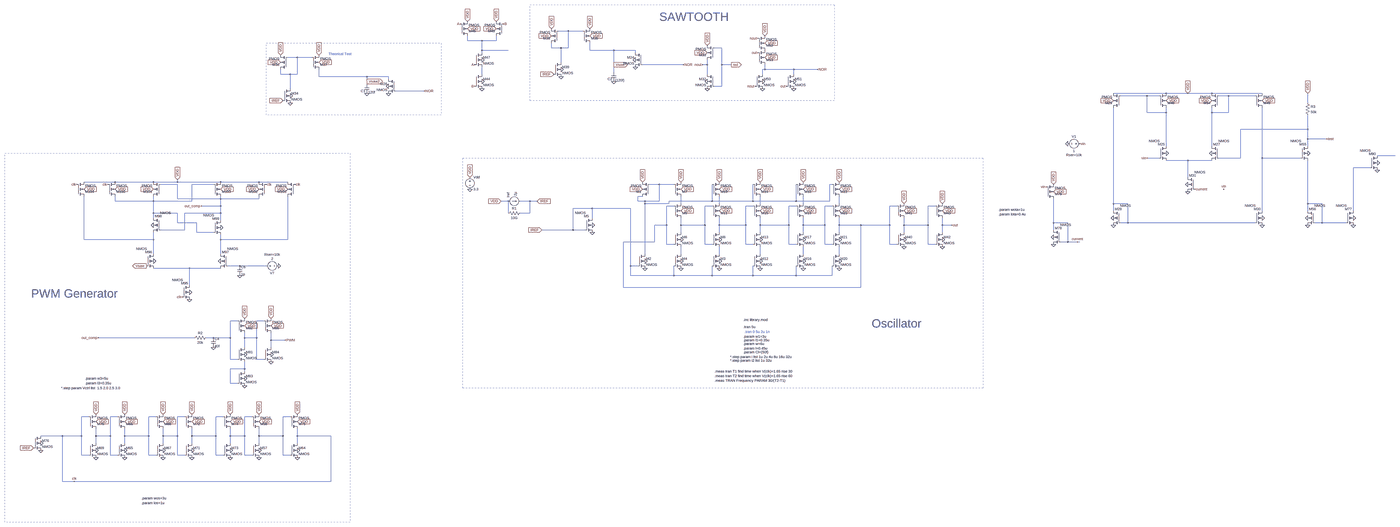
[diagram p0: schematic projet.asc, whole sheet]
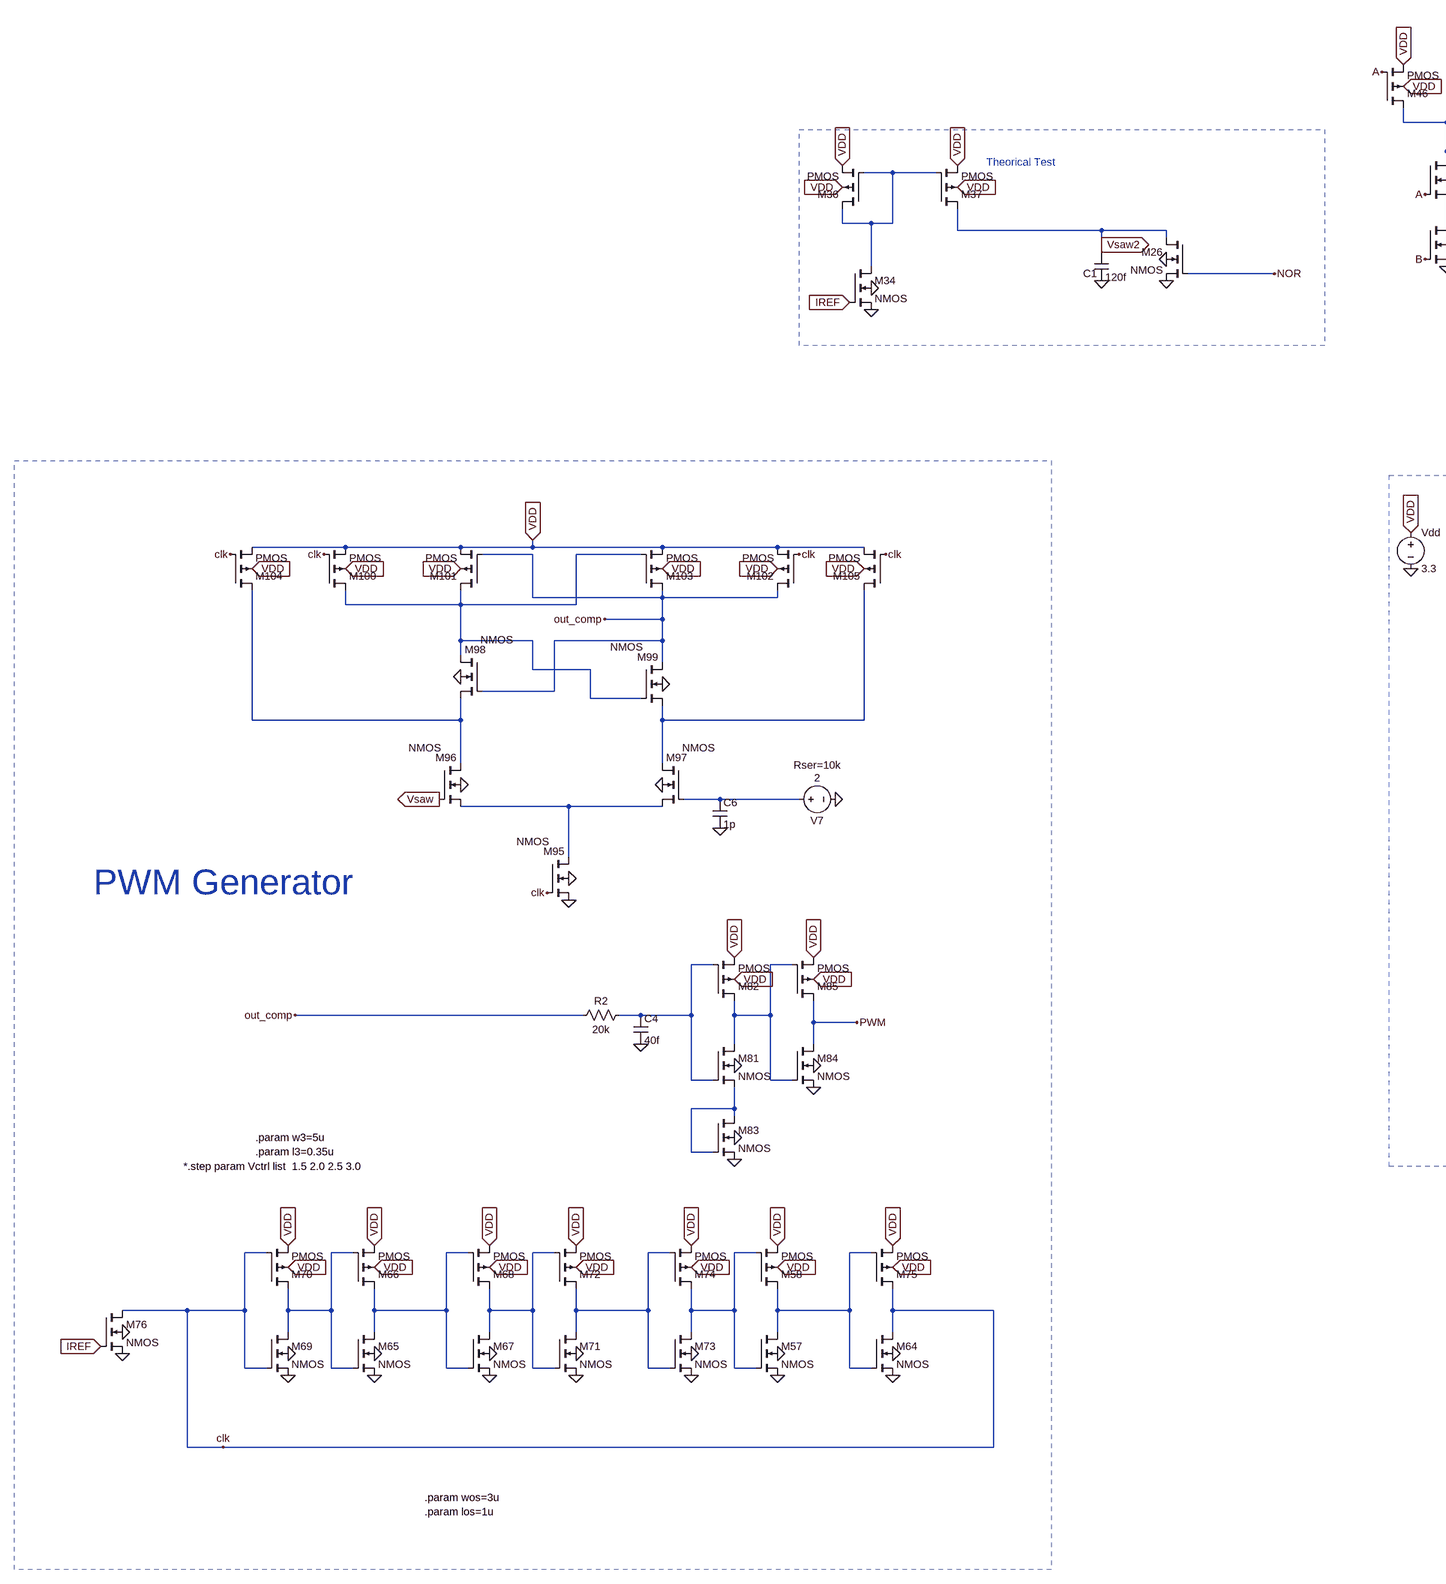
[diagram p1: schematic projet.asc, part, row 1 of 1, column 1 of 3]
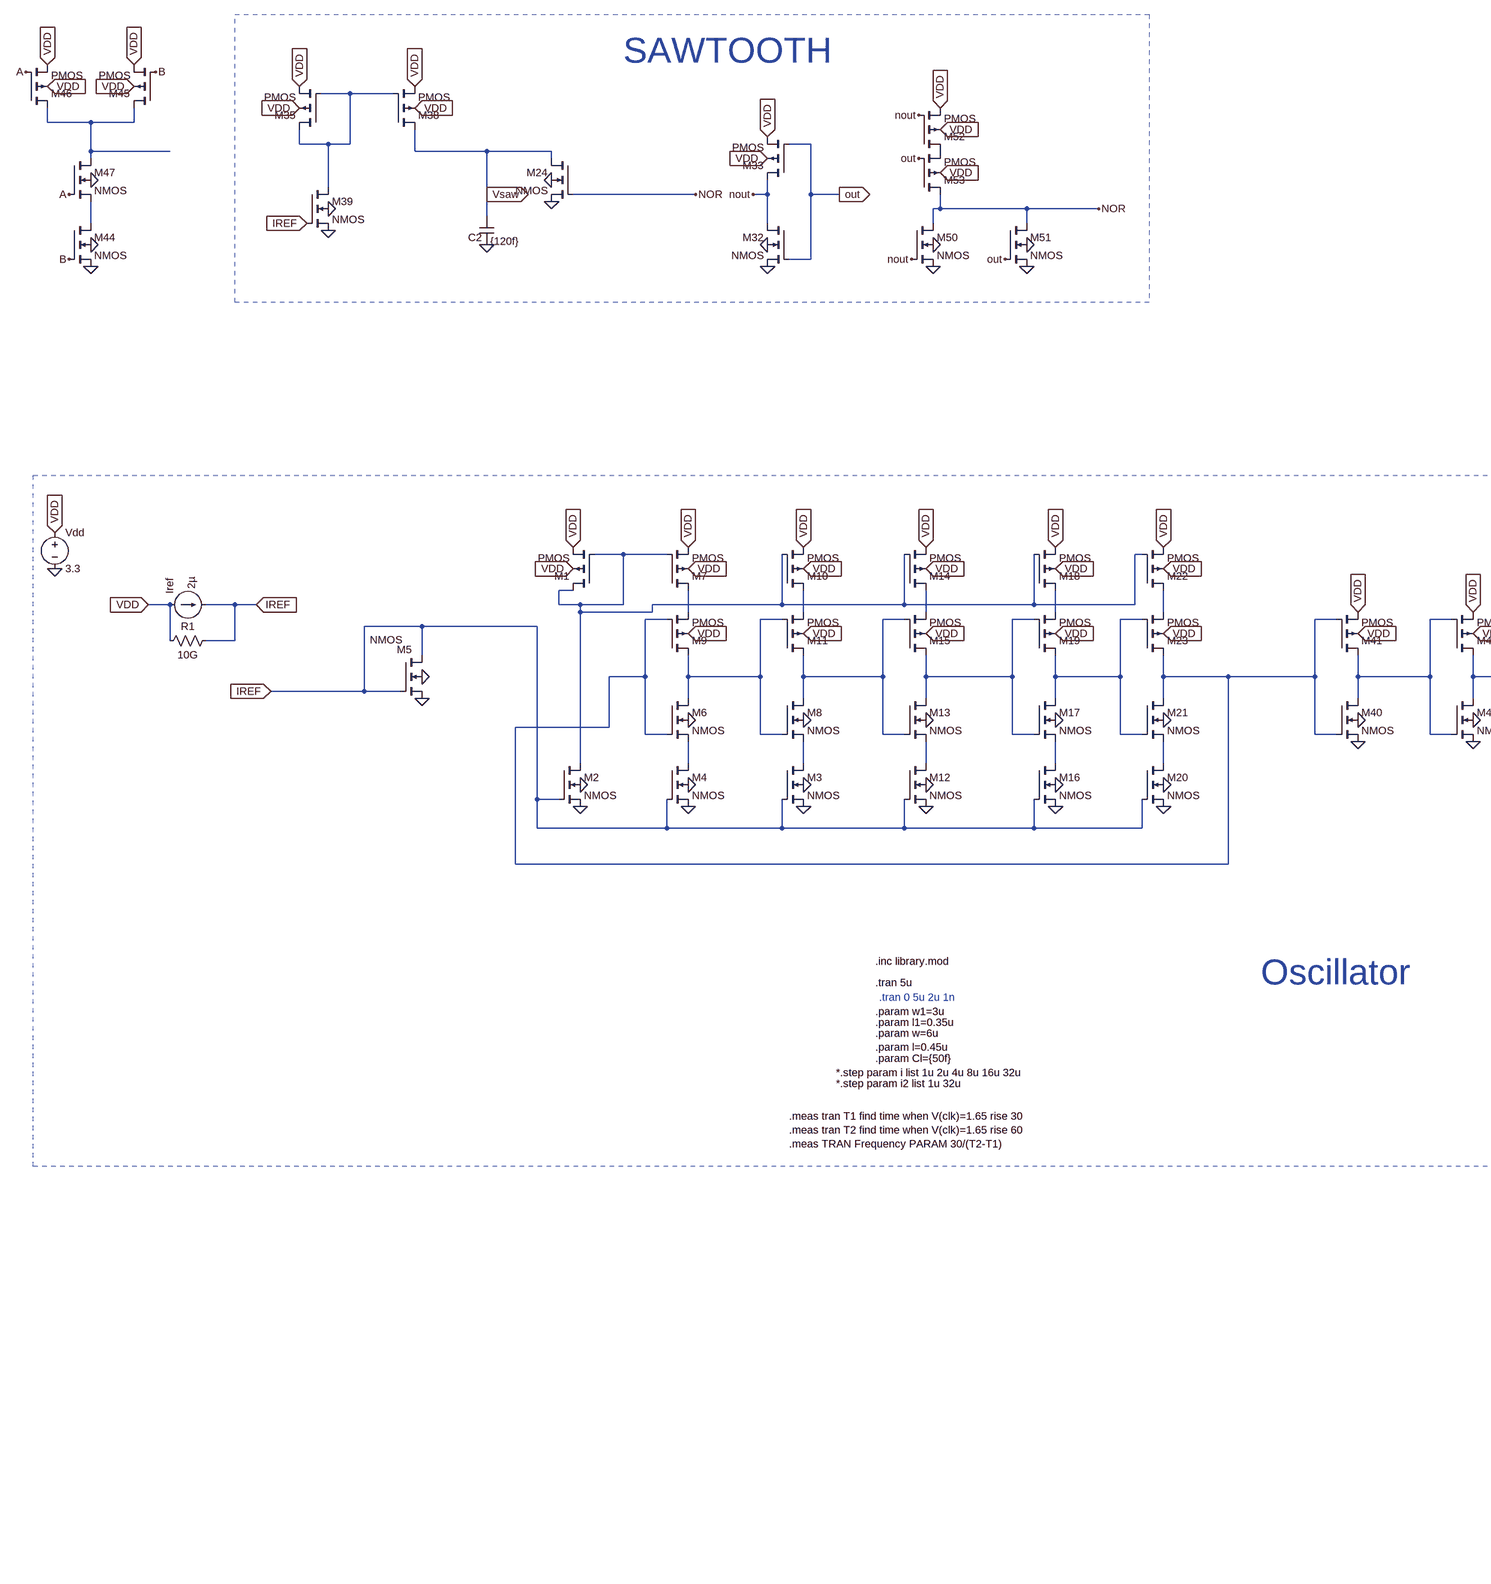
[diagram p2: schematic projet.asc, part, row 1 of 1, column 2 of 3]
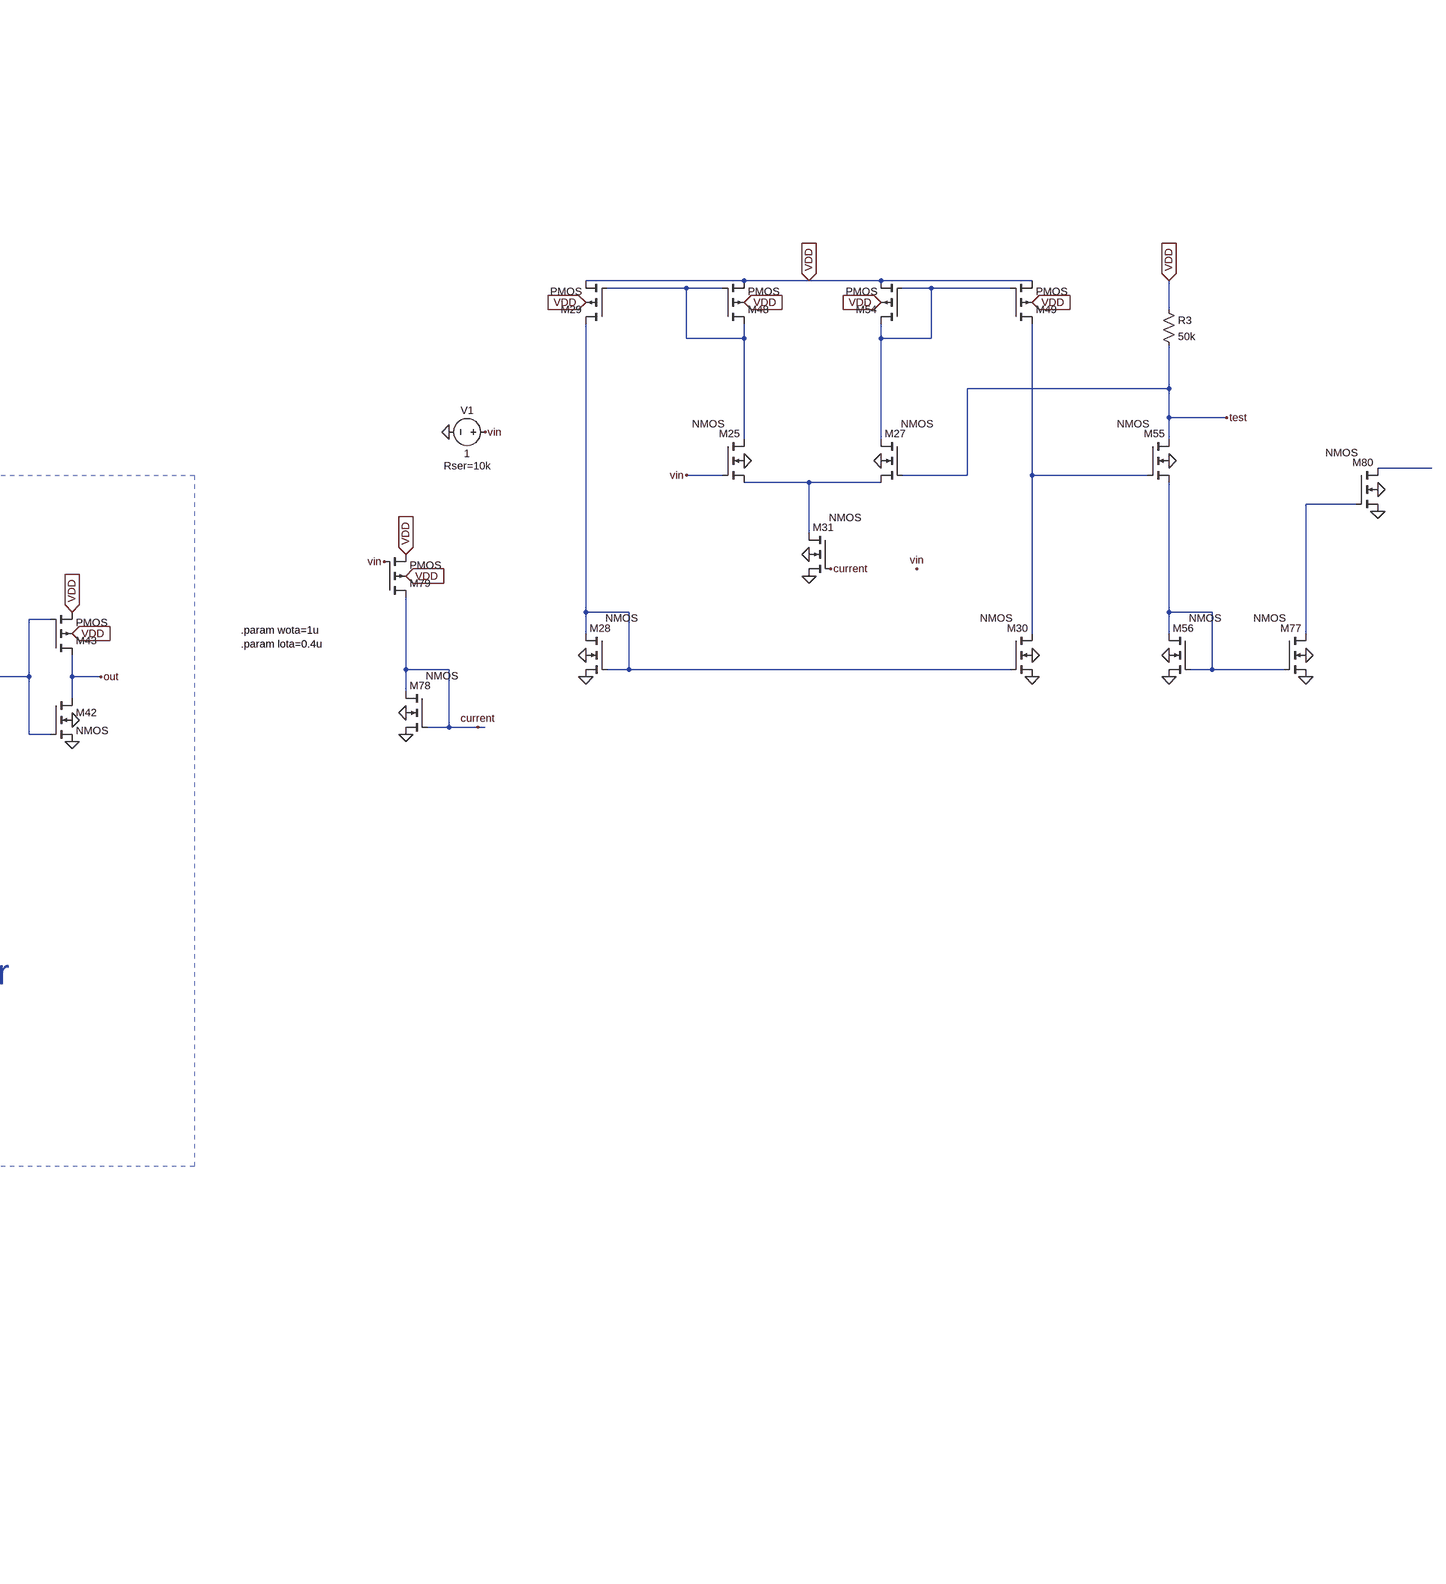
[diagram p3: schematic projet.asc, part, row 1 of 1, column 3 of 3]
projet.asc, the LTspice schematic file:
Version 4
SHEET 1 7924 3336
WIRE 1344 -800 1280 -800
WIRE 1440 -800 1344 -800
WIRE 672 -736 672 -768
WIRE 768 -736 672 -736
WIRE 864 -736 864 -768
WIRE 864 -736 768 -736
WIRE 1232 -688 1232 -720
WIRE 1296 -688 1232 -688
WIRE 1344 -688 1344 -800
WIRE 1344 -688 1296 -688
WIRE 2368 -688 2320 -688
WIRE 768 -672 768 -736
WIRE 944 -672 768 -672
WIRE 1488 -672 1488 -720
WIRE 1648 -672 1488 -672
WIRE 1792 -672 1648 -672
WIRE 768 -656 768 -672
WIRE 1792 -656 1792 -672
WIRE -1408 -624 -1472 -624
WIRE -1312 -624 -1408 -624
WIRE 1296 -592 1296 -688
WIRE 1648 -576 1648 -672
WIRE 2112 -576 1840 -576
WIRE 2272 -576 2272 -608
WIRE 2272 -576 2240 -576
WIRE 2368 -576 2368 -688
WIRE 2432 -576 2368 -576
WIRE 2656 -544 2656 -576
WIRE 2656 -544 2640 -544
WIRE 2848 -544 2656 -544
WIRE 3008 -544 2848 -544
WIRE 1648 -528 1648 -576
WIRE -1520 -512 -1520 -544
WIRE -1456 -512 -1520 -512
WIRE -1408 -512 -1408 -624
WIRE -1408 -512 -1456 -512
WIRE 768 -512 768 -560
WIRE 2272 -512 2272 -576
WIRE 2640 -512 2640 -544
WIRE 2848 -512 2848 -544
WIRE -1264 -496 -1264 -544
WIRE -944 -496 -1264 -496
WIRE -800 -496 -944 -496
WIRE -800 -480 -800 -496
WIRE -944 -464 -944 -496
WIRE -944 -448 -944 -464
WIRE 2368 -432 2368 -576
WIRE 2368 -432 2320 -432
WIRE -1456 -416 -1456 -512
WIRE -560 -400 -752 -400
WIRE 6240 -384 5888 -384
WIRE 6384 -384 6240 -384
WIRE 6544 -384 6384 -384
WIRE 6880 -384 6544 -384
WIRE 6112 -368 5936 -368
WIRE 6192 -368 6112 -368
WIRE 6656 -368 6592 -368
WIRE 6832 -368 6656 -368
WIRE 7264 -320 7264 -384
WIRE 6112 -256 6112 -368
WIRE 6240 -256 6240 -288
WIRE 6240 -256 6112 -256
WIRE 6544 -256 6544 -288
WIRE 6656 -256 6656 -368
WIRE 6656 -256 6544 -256
WIRE 7264 -144 7264 -240
WIRE 7264 -144 6736 -144
WIRE 7264 -80 7264 -144
WIRE 7392 -80 7264 -80
WIRE 6240 -32 6240 -256
WIRE 6544 -32 6544 -256
WIRE 7264 -32 7264 -80
WIRE 7920 32 7728 32
WIRE 6192 48 6112 48
WIRE 6736 48 6736 -144
WIRE 6736 48 6592 48
WIRE 6880 48 6880 -288
WIRE 7216 48 6880 48
WIRE 6384 64 6240 64
WIRE 6544 64 6384 64
WIRE 7680 112 7568 112
WIRE 6384 176 6384 64
WIRE -2624 208 -2832 208
WIRE -2368 208 -2624 208
WIRE -2208 208 -2208 192
WIRE -2208 208 -2368 208
WIRE -1920 208 -2208 208
WIRE -1664 208 -1920 208
WIRE -1472 208 -1664 208
WIRE -2208 224 -2320 224
WIRE -1968 224 -2112 224
WIRE 1952 224 1888 224
WIRE 2048 224 1952 224
WIRE 3104 224 3088 224
WIRE 1840 304 1808 304
WIRE -2208 320 -2208 224
WIRE -1920 320 -1920 304
WIRE -1920 320 -2208 320
WIRE -1664 320 -1664 304
WIRE -1664 320 -1920 320
WIRE -2624 336 -2624 304
WIRE -2368 336 -2368 304
WIRE -2368 336 -2624 336
WIRE -2112 336 -2112 224
WIRE -2112 336 -2368 336
WIRE 944 336 896 336
WIRE 1088 336 1024 336
WIRE 1136 336 1088 336
WIRE 1808 336 1808 304
WIRE 1856 336 1808 336
WIRE 1952 336 1952 224
WIRE 1952 336 1856 336
WIRE 2304 336 2304 224
WIRE 2304 336 2016 336
WIRE 2576 336 2576 224
WIRE 2576 336 2304 336
WIRE 2864 336 2864 224
WIRE 2864 336 2576 336
WIRE 3088 336 3088 224
WIRE 3088 336 2864 336
WIRE 1856 352 1856 336
WIRE 2016 352 2016 336
WIRE 2016 352 1856 352
WIRE 2096 352 2096 304
WIRE 2352 352 2352 304
WIRE 2624 352 2624 304
WIRE 2912 352 2912 304
WIRE 3152 352 3152 304
WIRE 5888 352 5888 -288
WIRE 5984 352 5888 352
WIRE 7264 352 7264 64
WIRE 7360 352 7264 352
WIRE -1920 368 -1920 320
WIRE -1920 368 -2048 368
WIRE 2048 368 2000 368
WIRE 2304 368 2256 368
WIRE 2576 368 2528 368
WIRE 2864 368 2816 368
WIRE 3104 368 3056 368
WIRE 3536 368 3488 368
WIRE 3792 368 3744 368
WIRE 1504 384 1376 384
WIRE 1760 384 1504 384
WIRE 5888 400 5888 352
WIRE 6880 400 6880 48
WIRE 7264 400 7264 352
WIRE 7568 400 7568 112
WIRE -2368 416 -2368 336
WIRE -2208 416 -2368 416
WIRE -1920 416 -1920 368
WIRE -1920 416 -2160 416
WIRE 944 416 944 336
WIRE 1088 416 1088 336
WIRE 1088 416 1024 416
WIRE -2368 448 -2368 416
WIRE 1504 448 1504 384
WIRE -1920 464 -1920 416
WIRE -2208 480 -2208 416
WIRE -2080 480 -2208 480
WIRE 5280 480 5280 320
WIRE 5376 480 5280 480
WIRE 5984 480 5984 352
WIRE 5984 480 5936 480
WIRE 6832 480 5984 480
WIRE 7360 480 7360 352
WIRE 7360 480 7312 480
WIRE 7520 480 7360 480
WIRE 2000 496 2000 368
WIRE 2000 496 1920 496
WIRE 2096 496 2096 448
WIRE 2256 496 2256 368
WIRE 2256 496 2096 496
WIRE 2352 496 2352 448
WIRE 2528 496 2528 368
WIRE 2528 496 2352 496
WIRE 2624 496 2624 448
WIRE 2816 496 2816 368
WIRE 2816 496 2624 496
WIRE 2912 496 2912 448
WIRE 3056 496 3056 368
WIRE 3056 496 2912 496
WIRE 3152 496 3152 448
WIRE 3296 496 3152 496
WIRE 3488 496 3488 368
WIRE 3488 496 3296 496
WIRE 3584 496 3584 448
WIRE 3744 496 3744 368
WIRE 3744 496 3584 496
WIRE 3840 496 3840 448
WIRE 3904 496 3840 496
WIRE -2160 528 -2160 416
WIRE -2160 528 -2320 528
WIRE 1376 528 1376 384
WIRE 1376 528 1168 528
WIRE 1456 528 1376 528
WIRE 5280 528 5280 480
WIRE -2080 544 -2080 480
WIRE -1968 544 -2080 544
WIRE 2096 544 2096 496
WIRE 2352 544 2352 496
WIRE 2624 544 2624 496
WIRE 2912 544 2912 496
WIRE 3152 544 3152 496
WIRE 3584 544 3584 496
WIRE 3840 544 3840 496
WIRE -2832 592 -2832 304
WIRE -2368 592 -2368 544
WIRE -2368 592 -2832 592
WIRE -1920 592 -1920 560
WIRE -1472 592 -1472 304
WIRE -1472 592 -1920 592
WIRE 1920 608 1920 496
WIRE 1920 608 1712 608
WIRE 5376 608 5376 480
WIRE 5376 608 5328 608
WIRE 5440 608 5376 608
WIRE 5456 608 5440 608
WIRE 2000 624 2000 496
WIRE 2048 624 2000 624
WIRE 2256 624 2256 496
WIRE 2304 624 2256 624
WIRE 2528 624 2528 496
WIRE 2576 624 2528 624
WIRE 2816 624 2816 496
WIRE 2864 624 2816 624
WIRE 3056 624 3056 496
WIRE 3104 624 3056 624
WIRE 3488 624 3488 496
WIRE 3536 624 3488 624
WIRE 3744 624 3744 496
WIRE 3792 624 3744 624
WIRE -2368 688 -2368 592
WIRE -1920 688 -1920 592
WIRE 1856 688 1856 352
WIRE 2096 688 2096 640
WIRE 2352 688 2352 640
WIRE 2624 688 2624 640
WIRE 2912 688 2912 640
WIRE 3152 688 3152 640
WIRE -1792 768 -1872 768
WIRE -1616 768 -1792 768
WIRE 1760 768 1760 384
WIRE 1808 768 1760 768
WIRE -2128 784 -2368 784
WIRE -1920 784 -2128 784
WIRE 1760 832 1760 768
WIRE 2048 832 2048 768
WIRE 2048 832 1760 832
WIRE 2304 832 2304 768
WIRE 2304 832 2048 832
WIRE 2576 832 2576 768
WIRE 2576 832 2304 832
WIRE 2864 832 2864 768
WIRE 2864 832 2576 832
WIRE 3104 832 3104 768
WIRE 3104 832 2864 832
WIRE -2128 896 -2128 784
WIRE 1712 912 1712 608
WIRE 3296 912 3296 496
WIRE 3296 912 1712 912
WIRE -1808 1136 -1856 1136
WIRE -1632 1136 -1680 1136
WIRE -2096 1248 -2736 1248
WIRE -1968 1248 -2016 1248
WIRE -1856 1248 -1856 1136
WIRE -1856 1248 -1968 1248
WIRE -1760 1248 -1760 1216
WIRE -1680 1248 -1680 1136
WIRE -1680 1248 -1760 1248
WIRE -1584 1264 -1584 1216
WIRE -1488 1264 -1584 1264
WIRE -1760 1312 -1760 1248
WIRE -1584 1312 -1584 1264
WIRE -1856 1392 -1856 1248
WIRE -1808 1392 -1856 1392
WIRE -1680 1392 -1680 1248
WIRE -1632 1392 -1680 1392
WIRE -1760 1456 -1760 1408
WIRE -1760 1456 -1856 1456
WIRE -1760 1472 -1760 1456
WIRE -1856 1552 -1856 1456
WIRE -1808 1552 -1856 1552
WIRE -2800 1776 -2848 1776
WIRE -2608 1776 -2656 1776
WIRE -2352 1776 -2400 1776
WIRE -2160 1776 -2208 1776
WIRE -1904 1776 -1952 1776
WIRE -1712 1776 -1760 1776
WIRE -1456 1776 -1504 1776
WIRE -2976 1904 -3120 1904
WIRE -2848 1904 -2848 1776
WIRE -2848 1904 -2976 1904
WIRE -2752 1904 -2752 1856
WIRE -2656 1904 -2656 1776
WIRE -2656 1904 -2752 1904
WIRE -2560 1904 -2560 1856
WIRE -2400 1904 -2400 1776
WIRE -2400 1904 -2560 1904
WIRE -2304 1904 -2304 1856
WIRE -2208 1904 -2208 1776
WIRE -2208 1904 -2304 1904
WIRE -2112 1904 -2112 1856
WIRE -1952 1904 -1952 1776
WIRE -1952 1904 -2112 1904
WIRE -1856 1904 -1856 1856
WIRE -1760 1904 -1760 1776
WIRE -1760 1904 -1856 1904
WIRE -1664 1904 -1664 1856
WIRE -1504 1904 -1504 1776
WIRE -1504 1904 -1664 1904
WIRE -1408 1904 -1408 1856
WIRE -1184 1904 -1408 1904
WIRE -2752 1952 -2752 1904
WIRE -2560 1952 -2560 1904
WIRE -2304 1952 -2304 1904
WIRE -2112 1952 -2112 1904
WIRE -1856 1952 -1856 1904
WIRE -1664 1952 -1664 1904
WIRE -1408 1952 -1408 1904
WIRE -2848 2032 -2848 1904
WIRE -2800 2032 -2848 2032
WIRE -2656 2032 -2656 1904
WIRE -2608 2032 -2656 2032
WIRE -2400 2032 -2400 1904
WIRE -2352 2032 -2400 2032
WIRE -2208 2032 -2208 1904
WIRE -2160 2032 -2208 2032
WIRE -1952 2032 -1952 1904
WIRE -1904 2032 -1952 2032
WIRE -1760 2032 -1760 1904
WIRE -1712 2032 -1760 2032
WIRE -1504 2032 -1504 1904
WIRE -1456 2032 -1504 2032
WIRE -2976 2208 -2976 1904
WIRE -2896 2208 -2976 2208
WIRE -1184 2208 -1184 1904
WIRE -1184 2208 -2896 2208
FLAG 688 176 VDD
IOPIN 688 176 In
FLAG 688 256 0
FLAG 1840 208 VDD
IOPIN 1840 208 In
FLAG 1840 256 VDD
IOPIN 1840 256 In
FLAG 1856 736 0
FLAG 1856 784 0
FLAG 2096 736 0
FLAG 2096 784 0
FLAG 1504 496 0
FLAG 2096 592 0
FLAG 2096 208 VDD
IOPIN 2096 208 In
FLAG 2096 256 VDD
IOPIN 2096 256 In
FLAG 2096 400 VDD
IOPIN 2096 400 In
FLAG 2352 736 0
FLAG 2352 784 0
FLAG 2352 592 0
FLAG 2352 208 VDD
IOPIN 2352 208 In
FLAG 2352 256 VDD
IOPIN 2352 256 In
FLAG 2352 400 VDD
IOPIN 2352 400 In
FLAG 2624 736 0
FLAG 2624 784 0
FLAG 2624 592 0
FLAG 2624 208 VDD
IOPIN 2624 208 In
FLAG 2624 256 VDD
IOPIN 2624 256 In
FLAG 2624 400 VDD
IOPIN 2624 400 In
FLAG 2912 736 0
FLAG 2912 784 0
FLAG 2912 592 0
FLAG 2912 208 VDD
IOPIN 2912 208 In
FLAG 2912 256 VDD
IOPIN 2912 256 In
FLAG 2912 400 VDD
IOPIN 2912 400 In
FLAG 3152 736 0
FLAG 3152 784 0
FLAG 3152 592 0
FLAG 3152 208 VDD
IOPIN 3152 208 In
FLAG 3152 256 VDD
IOPIN 3152 256 In
FLAG 3152 400 VDD
IOPIN 3152 400 In
FLAG 1504 544 0
FLAG 1648 -464 0
FLAG 1792 -608 0
FLAG 1792 -560 0
FLAG 1648 -576 Vsaw
IOPIN 1648 -576 Out
FLAG -944 -384 0
FLAG -800 -432 0
FLAG -800 -384 0
FLAG -944 -464 Vsaw2
IOPIN -944 -464 Out
FLAG 1168 528 IREF
IOPIN 1168 528 In
FLAG 1136 336 IREF
IOPIN 1136 336 In
FLAG 2272 -464 0
FLAG 2272 -656 VDD
IOPIN 2272 -656 In
FLAG 2272 -704 VDD
IOPIN 2272 -704 In
FLAG 2272 -416 0
FLAG -1520 -640 VDD
IOPIN -1520 -640 In
FLAG -1520 -592 VDD
IOPIN -1520 -592 In
FLAG -1264 -640 VDD
IOPIN -1264 -640 In
FLAG -1264 -592 VDD
IOPIN -1264 -592 In
FLAG -1456 -368 0
FLAG -1456 -320 0
FLAG -1504 -336 IREF
IOPIN -1504 -336 In
FLAG 1232 -816 VDD
IOPIN 1232 -816 In
FLAG 1232 -768 VDD
IOPIN 1232 -768 In
FLAG 1488 -816 VDD
IOPIN 1488 -816 In
FLAG 1488 -768 VDD
IOPIN 1488 -768 In
FLAG 1296 -544 0
FLAG 1296 -496 0
FLAG 1248 -512 IREF
IOPIN 1248 -512 In
FLAG 2432 -576 out
IOPIN 2432 -576 Out
FLAG 3584 592 0
FLAG 3584 400 VDD
IOPIN 3584 400 In
FLAG 3584 352 VDD
IOPIN 3584 352 In
FLAG 3584 640 0
FLAG 3840 592 0
FLAG 3840 400 VDD
IOPIN 3840 400 In
FLAG 3840 352 VDD
IOPIN 3840 352 In
FLAG 3840 640 0
FLAG 3904 496 out
FLAG 896 336 VDD
IOPIN 896 336 In
FLAG 864 -864 VDD
IOPIN 864 -864 In
FLAG 864 -816 VDD
IOPIN 864 -816 In
FLAG 768 -464 0
FLAG 768 -416 0
FLAG 672 -864 VDD
IOPIN 672 -864 In
FLAG 672 -816 VDD
IOPIN 672 -816 In
FLAG 768 -608 0
FLAG 912 -848 B
FLAG 720 -432 B
FLAG 720 -576 A
FLAG 2640 -464 0
FLAG 2640 -416 0
FLAG 2848 -464 0
FLAG 2848 -416 0
FLAG 2656 -768 VDD
IOPIN 2656 -768 In
FLAG 2656 -720 VDD
IOPIN 2656 -720 In
FLAG 2656 -624 VDD
IOPIN 2656 -624 In
FLAG 2608 -752 nout
FLAG 2592 -432 nout
FLAG 3008 -544 NOR
FLAG 2608 -656 out
FLAG 2800 -432 out
FLAG 2240 -576 nout
FLAG 2112 -576 NOR
FLAG 624 -848 A
FLAG -560 -400 NOR
FLAG -2560 2000 0
FLAG -2560 1808 VDD
IOPIN -2560 1808 In
FLAG -2560 1760 VDD
IOPIN -2560 1760 In
FLAG -2560 2048 0
FLAG -2304 2000 0
FLAG -2304 1808 VDD
IOPIN -2304 1808 In
FLAG -2304 1760 VDD
IOPIN -2304 1760 In
FLAG -2304 2048 0
FLAG -2752 2000 0
FLAG -2752 1808 VDD
IOPIN -2752 1808 In
FLAG -2752 1760 VDD
IOPIN -2752 1760 In
FLAG -2752 2048 0
FLAG -2896 2208 clk
FLAG -2112 2000 0
FLAG -2112 1808 VDD
IOPIN -2112 1808 In
FLAG -2112 1760 VDD
IOPIN -2112 1760 In
FLAG -2112 2048 0
FLAG -1856 2000 0
FLAG -1856 1808 VDD
IOPIN -1856 1808 In
FLAG -1856 1760 VDD
IOPIN -1856 1760 In
FLAG -1856 2048 0
FLAG -1664 2000 0
FLAG -1664 1808 VDD
IOPIN -1664 1808 In
FLAG -1664 1760 VDD
IOPIN -1664 1760 In
FLAG -1664 2048 0
FLAG -1408 2000 0
FLAG -1408 1808 VDD
IOPIN -1408 1808 In
FLAG -1408 1760 VDD
IOPIN -1408 1760 In
FLAG -1408 2048 0
FLAG -3120 1952 0
FLAG -3120 2000 0
FLAG -3168 1984 IREF
IOPIN -3168 1984 In
FLAG -1968 1312 0
FLAG -1760 1360 0
FLAG -1760 1168 VDD
IOPIN -1760 1168 In
FLAG -1760 1120 VDD
IOPIN -1760 1120 In
FLAG -1760 1520 0
FLAG -1760 1568 0
FLAG -1584 1360 0
FLAG -1584 1168 VDD
IOPIN -1584 1168 In
FLAG -1584 1120 VDD
IOPIN -1584 1120 In
FLAG -1584 1408 0
FLAG -2128 944 0
FLAG -2128 992 0
FLAG -2176 976 clk
FLAG -2368 736 0
FLAG -1920 736 0
FLAG -2368 496 0
FLAG -1920 512 0
FLAG -2624 256 VDD
IOPIN -2624 256 In
FLAG -2368 256 VDD
IOPIN -2368 256 In
FLAG -1664 256 VDD
IOPIN -1664 256 In
FLAG -1920 256 VDD
IOPIN -1920 256 In
FLAG -2208 192 VDD
IOPIN -2208 192 In
FLAG -1616 224 clk
FLAG -2672 224 clk
FLAG -2832 256 VDD
IOPIN -2832 256 In
FLAG -2880 224 clk
FLAG -1472 256 VDD
IOPIN -1472 256 In
FLAG -1424 224 clk
FLAG -1536 768 0
FLAG -1792 832 0
FLAG -2048 368 out_comp
FLAG -2736 1248 out_comp
FLAG -1488 1264 PWM
FLAG -2416 768 Vsaw
IOPIN -2416 768 Out
FLAG 6240 16 0
FLAG 5376 -48 0
FLAG 6544 16 0
FLAG 5888 448 0
FLAG 5888 496 0
FLAG 6880 448 0
FLAG 6880 496 0
FLAG 6384 224 0
FLAG 6384 272 0
FLAG 5888 -336 VDD
IOPIN 5888 -336 In
FLAG 6240 -336 VDD
IOPIN 6240 -336 In
FLAG 6880 -336 VDD
IOPIN 6880 -336 In
FLAG 6544 -336 VDD
IOPIN 6544 -336 In
FLAG 6384 -384 VDD
IOPIN 6384 -384 In
FLAG 7264 -384 VDD
IOPIN 7264 -384 In
FLAG 7264 16 0
FLAG 7264 448 0
FLAG 7264 496 0
FLAG 7568 448 0
FLAG 7568 496 0
FLAG 5456 -48 vin
FLAG 5280 576 0
FLAG 5280 624 0
FLAG 5280 272 VDD
IOPIN 5280 272 In
FLAG 5280 224 VDD
IOPIN 5280 224 In
FLAG 5232 240 vin
FLAG 6432 256 current
FLAG 5440 608 current
FLAG 6112 48 vin
FLAG 6624 256 vin
FLAG 7392 -80 test
FLAG 7728 80 0
FLAG 7728 128 0
SYMBOL pmos4 1888 304 R180
SYMATTR InstName M1
SYMATTR Value2 l=l1 w=w1
SYMBOL voltage 688 160 R0
SYMATTR InstName Vdd
SYMATTR Value 3.3
SYMBOL current 944 336 R270
WINDOW 3 35 48 Left 2
WINDOW 123 0 0 Left 0
WINDOW 39 0 0 Left 0
SYMATTR Value 2µ
SYMATTR InstName Iref
SYMBOL nmos4 1808 688 R0
SYMATTR InstName M2
SYMATTR Value2 l=l1 w=w1
SYMBOL res 1040 400 R90
WINDOW 0 0 56 VBottom 2
WINDOW 3 32 56 VTop 2
SYMATTR InstName R1
SYMATTR Value 10G
SYMBOL nmos4 2048 688 R0
SYMATTR InstName M4
SYMATTR Value2 l=l w=w
SYMBOL nmos4 1456 448 R0
WINDOW 0 -8 -12 Left 2
WINDOW 3 -68 -34 Left 2
SYMATTR InstName M5
SYMATTR Value2 l=0.35u w=3u
SYMBOL nmos4 2048 544 R0
SYMATTR InstName M6
SYMATTR Value2 l=l w=w
SYMBOL pmos4 2048 304 M180
SYMATTR InstName M7
SYMATTR Value2 l=l w=w
SYMBOL pmos4 2048 448 M180
SYMATTR InstName M9
SYMATTR Value2 l=l w=w
SYMBOL nmos4 2304 688 R0
SYMATTR InstName M3
SYMATTR Value2 l=l w=w
SYMBOL nmos4 2304 544 R0
SYMATTR InstName M8
SYMATTR Value2 l=l w=w
SYMBOL pmos4 2304 304 M180
SYMATTR InstName M10
SYMATTR Value2 l=l w=w
SYMBOL pmos4 2304 448 M180
SYMATTR InstName M11
SYMATTR Value2 l=l w=w
SYMBOL nmos4 2576 688 R0
SYMATTR InstName M12
SYMATTR Value2 l=l w=w
SYMBOL nmos4 2576 544 R0
SYMATTR InstName M13
SYMATTR Value2 l=l w=w
SYMBOL pmos4 2576 304 M180
SYMATTR InstName M14
SYMATTR Value2 l=l w=w
SYMBOL pmos4 2576 448 M180
SYMATTR InstName M15
SYMATTR Value2 l=l w=w
SYMBOL nmos4 2864 688 R0
SYMATTR InstName M16
SYMATTR Value2 l=l w=w
SYMBOL nmos4 2864 544 R0
SYMATTR InstName M17
SYMATTR Value2 l=l w=w
SYMBOL pmos4 2864 304 M180
SYMATTR InstName M18
SYMATTR Value2 l=l w=w
SYMBOL pmos4 2864 448 M180
SYMATTR InstName M19
SYMATTR Value2 l=l w=w
SYMBOL nmos4 3104 688 R0
SYMATTR InstName M20
SYMATTR Value2 l=l w=w
SYMBOL nmos4 3104 544 R0
SYMATTR InstName M21
SYMATTR Value2 l=l w=w
SYMBOL pmos4 3104 304 M180
SYMATTR InstName M22
SYMATTR Value2 l=l w=w
SYMBOL pmos4 3104 448 M180
SYMATTR InstName M23
SYMATTR Value2 l=l w=w
SYMBOL cap 1632 -528 R0
WINDOW 0 -25 48 Left 2
SYMATTR InstName C2
SYMATTR Value {120f}
SYMBOL nmos4 1840 -656 M0
SYMATTR InstName M24
SYMATTR Value2 l=0.35u w=4u
SYMBOL cap -960 -448 R0
WINDOW 0 -25 48 Left 2
SYMATTR InstName C1
SYMATTR Value 120f
SYMBOL nmos4 -752 -480 M0
SYMATTR InstName M26
SYMATTR Value2 l=0.35u w=4u
SYMBOL nmos4 2320 -512 M0
SYMATTR InstName M32
SYMATTR Value2 l=l w=w
SYMBOL pmos4 2320 -608 R180
SYMATTR InstName M33
SYMATTR Value2 l=l w=w
SYMBOL pmos4 -1472 -544 R180
SYMATTR InstName M36
SYMATTR Value2 l=0.35u w={1u}
SYMBOL pmos4 -1312 -544 M180
SYMATTR InstName M37
SYMATTR Value2 l=0.75u w={2u}
SYMBOL nmos4 -1504 -416 R0
SYMATTR InstName M34
SYMATTR Value2 l=0.35u w=2u
SYMBOL pmos4 1280 -720 R180
SYMATTR InstName M35
SYMATTR Value2 l=0.35u w={1u}
SYMBOL pmos4 1440 -720 M180
SYMATTR InstName M38
SYMATTR Value2 l=0.75u w={2u}
SYMBOL nmos4 1248 -592 R0
SYMATTR InstName M39
SYMATTR Value2 l=0.35u w=2u
SYMBOL nmos4 3536 544 R0
SYMATTR InstName M40
SYMATTR Value2 l=l w=w
SYMBOL pmos4 3536 448 M180
SYMATTR InstName M41
SYMATTR Value2 l=l w=w
SYMBOL nmos4 3792 544 R0
SYMATTR InstName M42
SYMATTR Value2 l=l w=w
SYMBOL pmos4 3792 448 M180
SYMATTR InstName M43
SYMATTR Value2 l=l w=w
SYMBOL pmos4 912 -768 R180
SYMATTR InstName M45
SYMATTR Value2 l=0.35u w=0.4u
SYMBOL nmos4 720 -512 R0
SYMATTR InstName M44
SYMATTR Value2 l=0.35u w=2u
SYMBOL pmos4 624 -768 M180
SYMATTR InstName M46
SYMATTR Value2 l=0.35u w=1u
SYMBOL nmos4 720 -656 R0
SYMATTR InstName M47
SYMATTR Value2 l=0.35u w=20u
SYMBOL nmos4 2592 -512 R0
SYMATTR InstName M50
SYMATTR Value2 l=0.35u w=0.4u
SYMBOL nmos4 2800 -512 R0
SYMATTR InstName M51
SYMATTR Value2 l=0.35u w=2u
SYMBOL pmos4 2608 -672 M180
SYMATTR InstName M52
SYMATTR Value2 l=0.35u w=50u
SYMBOL pmos4 2608 -576 M180
SYMATTR InstName M53
SYMATTR Value2 l=0.35u w=10u
SYMBOL nmos4 -2608 1952 R0
SYMATTR InstName M65
SYMATTR Value2 l=los w=wos
SYMBOL pmos4 -2608 1856 M180
SYMATTR InstName M66
SYMATTR Value2 l=los w=wos
SYMBOL nmos4 -2352 1952 R0
SYMATTR InstName M67
SYMATTR Value2 l=los w=wos
SYMBOL pmos4 -2352 1856 M180
SYMATTR InstName M68
SYMATTR Value2 l=los w=wos
SYMBOL nmos4 -2800 1952 R0
SYMATTR InstName M69
SYMATTR Value2 l=los w=wos
SYMBOL pmos4 -2800 1856 M180
SYMATTR InstName M70
SYMATTR Value2 l=los w=wos
SYMBOL nmos4 -2160 1952 R0
SYMATTR InstName M71
SYMATTR Value2 l=los w=wos
SYMBOL pmos4 -2160 1856 M180
SYMATTR InstName M72
SYMATTR Value2 l=los w=wos
SYMBOL nmos4 -1904 1952 R0
SYMATTR InstName M73
SYMATTR Value2 l=los w=wos
SYMBOL pmos4 -1904 1856 M180
SYMATTR InstName M74
SYMATTR Value2 l=los w=wos
SYMBOL nmos4 -1712 1952 R0
SYMATTR InstName M57
SYMATTR Value2 l=los w=wos
SYMBOL pmos4 -1712 1856 M180
SYMATTR InstName M58
SYMATTR Value2 l=los w=wos
SYMBOL nmos4 -1456 1952 R0
SYMATTR InstName M64
SYMATTR Value2 l=los w=wos
SYMBOL pmos4 -1456 1856 M180
SYMATTR InstName M75
SYMATTR Value2 l=los w=wos
SYMBOL nmos4 -3168 1904 R0
SYMATTR InstName M76
SYMATTR Value2 l=0.7u w=1u
SYMBOL res -2000 1232 R90
WINDOW 0 0 56 VBottom 2
WINDOW 3 32 56 VTop 2
SYMATTR InstName R2
SYMATTR Value 20k
SYMBOL cap -1984 1248 R0
SYMATTR InstName C4
SYMATTR Value 40f
SYMBOL nmos4 -1808 1312 R0
SYMATTR InstName M81
SYMATTR Value2 l=350n w=1u
SYMBOL pmos4 -1808 1216 M180
SYMATTR InstName M82
SYMATTR Value2 l=0.35u w=50u
SYMBOL nmos4 -1808 1472 R0
SYMATTR InstName M83
SYMATTR Value2 l=0.35u w=50u
SYMBOL nmos4 -1632 1312 R0
SYMATTR InstName M84
SYMATTR Value2 l=l w=w
SYMBOL pmos4 -1632 1216 M180
SYMATTR InstName M85
SYMATTR Value2 l=l w=w
SYMBOL nmos4 -2176 896 R0
WINDOW 0 -8 -12 Left 2
WINDOW 3 -68 -34 Left 2
SYMATTR InstName M95
SYMATTR Value2 l=l3 w=w3
SYMBOL nmos4 -2416 688 R0
WINDOW 0 -8 -12 Left 2
WINDOW 3 -68 -34 Left 2
SYMATTR InstName M96
SYMATTR Value2 l=l3 w=w3
SYMBOL nmos4 -1872 688 M0
WINDOW 0 -8 -12 Left 2
WINDOW 3 -68 -34 Left 2
SYMATTR InstName M97
SYMATTR Value2 l=l3 w=w3
SYMBOL nmos4 -2320 448 M0
WINDOW 0 -8 -12 Left 2
WINDOW 3 -68 -34 Left 2
SYMATTR InstName M98
SYMATTR Value2 l=l3 w=w3
SYMBOL nmos4 -1968 464 R0
WINDOW 0 -8 -12 Left 2
WINDOW 3 -68 -34 Left 2
SYMATTR InstName M99
SYMATTR Value2 l=l3 w=w3
SYMBOL pmos4 -2672 304 M180
SYMATTR InstName M100
SYMATTR Value2 l=l3 w=w3
SYMBOL pmos4 -2320 304 R180
SYMATTR InstName M101
SYMATTR Value2 l=l3 w=w3
SYMBOL pmos4 -1616 304 R180
SYMATTR InstName M102
SYMATTR Value2 l=l3 w=w3
SYMBOL pmos4 -1968 304 M180
SYMATTR InstName M103
SYMATTR Value2 l=l3 w=w3
SYMBOL pmos4 -2880 304 M180
SYMATTR InstName M104
SYMATTR Value2 l=l3 w=w3
SYMBOL pmos4 -1424 304 R180
SYMATTR InstName M105
SYMATTR Value2 l=l3 w=w3
SYMBOL voltage -1632 768 R270
WINDOW 0 -32 56 VBottom 2
WINDOW 3 32 56 VTop 2
WINDOW 123 0 0 Left 0
WINDOW 39 60 56 VTop 2
SYMATTR InstName V7
SYMATTR Value 2
SYMATTR SpiceLine Rser=10k
SYMBOL cap -1808 768 R0
SYMATTR InstName C6
SYMATTR Value 1p
SYMBOL nmos4 6192 -32 R0
WINDOW 0 -8 -12 Left 2
WINDOW 3 -68 -34 Left 2
SYMATTR InstName M25
SYMATTR Value2 l=lota w=wota
SYMBOL voltage 5472 -48 R90
WINDOW 0 -32 56 VBottom 2
WINDOW 3 32 56 VTop 2
WINDOW 123 0 0 Left 0
WINDOW 39 60 56 VTop 2
SYMATTR InstName V1
SYMATTR Value 1
SYMATTR SpiceLine Rser=10k
SYMBOL nmos4 6592 -32 M0
WINDOW 0 -8 -12 Left 2
WINDOW 3 -68 -34 Left 2
SYMATTR InstName M27
SYMATTR Value2 l=lota w=wota
SYMBOL nmos4 5936 400 M0
WINDOW 0 -8 -12 Left 2
WINDOW 3 -68 -34 Left 2
SYMATTR InstName M28
SYMATTR Value2 l=lota w=wota
SYMBOL nmos4 6832 400 R0
WINDOW 0 -8 -12 Left 2
WINDOW 3 -68 -34 Left 2
SYMATTR InstName M30
SYMATTR Value2 l=lota w={2*wota}
SYMBOL nmos4 6432 176 M0
WINDOW 0 -8 -12 Left 2
WINDOW 3 -68 -34 Left 2
SYMATTR InstName M31
SYMATTR Value2 l=lota w=wota
SYMBOL pmos4 5936 -288 R180
SYMATTR InstName M29
SYMATTR Value2 l=lota w={2*wota}
SYMBOL pmos4 6192 -288 M180
SYMATTR InstName M48
SYMATTR Value2 l=lota w={wota}
SYMBOL pmos4 6832 -288 M180
SYMATTR InstName M49
SYMATTR Value2 l=lota w={2*wota}
SYMBOL pmos4 6592 -288 R180
SYMATTR InstName M54
SYMATTR Value2 l=lota w={wota}
SYMBOL res 7248 -336 R0
SYMATTR InstName R3
SYMATTR Value 50k
SYMBOL nmos4 7216 -32 R0
WINDOW 0 -8 -12 Left 2
WINDOW 3 -68 -34 Left 2
SYMATTR InstName M55
SYMATTR Value2 l=lota w=wota
SYMBOL nmos4 7312 400 M0
WINDOW 0 -8 -12 Left 2
WINDOW 3 -68 -34 Left 2
SYMATTR InstName M56
SYMATTR Value2 l=lota w=wota
SYMBOL nmos4 7520 400 R0
WINDOW 0 -8 -12 Left 2
WINDOW 3 -68 -34 Left 2
SYMATTR InstName M77
SYMATTR Value2 l=lota w={wota}
SYMBOL nmos4 5328 528 M0
WINDOW 0 -8 -12 Left 2
WINDOW 3 -68 -34 Left 2
SYMATTR InstName M78
SYMATTR Value2 l=lota w=wota
SYMBOL pmos4 5232 320 M180
SYMATTR InstName M79
SYMATTR Value2 l=lota w={wota}
SYMBOL nmos4 7680 32 R0
WINDOW 0 -8 -12 Left 2
WINDOW 3 -68 -34 Left 2
SYMATTR InstName M80
SYMATTR Value2 l=lota w={wota}
TEXT 2512 1128 Left 2 !.inc library.mod
TEXT 2512 1288 Left 2 !.param w=6u\n.param l=0.45u
TEXT 2512 1176 Left 2 !.tran 5u
TEXT 2320 1472 Left 2 !.meas tran T1 find time when V(clk)=1.65 rise 30\n.meas tran T2 find time when V(clk)=1.65 rise 60\n.meas TRAN Frequency PARAM 30/(T2-T1)
TEXT 2424 1376 Left 2 !*.step param i list 1u 2u 4u 8u 16u 32u
TEXT 2512 1344 Left 2 !.param Cl={50f}
TEXT 2512 1240 Left 2 !.param w1=3u
TEXT 2512 1264 Left 2 !.param l1=0.35u
TEXT 2520 1208 Left 2 ;.tran 0 5u 2u 1n
TEXT 2424 1400 Left 2 !*.step param i2 list 1u 32u
TEXT -1200 -648 Left 2 ;Theorical Test
TEXT -2984 1584 Left 2 !*.step param Vctrl list  1.5 2.0 2.5 3.0
TEXT 1952 -896 Left 6 ;SAWTOOTH
TEXT -2824 1520 Left 2 !.param w3=5u\n.param l3=0.35u
TEXT -2448 2320 Left 2 !.param wos=3u\n.param los=1u
TEXT -3184 952 Left 6 ;PWM Generator
TEXT 3368 1152 Left 6 ;Oscillator
TEXT 4832 392 Left 2 !.param wota=1u\n.param lota=0.4u
RECTANGLE Normal -1616 -720 -448 -240 2
RECTANGLE Normal 3120 -336 1088 -976 2
RECTANGLE Normal -1056 2480 -3360 16 2
RECTANGLE Normal 4112 1584 640 48 2

The netlist it stands for:
* projet.asc
M1 N012 N012 VDD VDD PMOS l=l1 w=w1
Vdd VDD 0 3.3
Iref VDD IREF 2µ
M2 N012 IREF 0 0 NMOS l=l1 w=w1
R1 IREF VDD 10G
M4 N028 IREF 0 0 NMOS l=l w=w
M5 IREF IREF 0 0 NMOS l=0.35u w=3u
M6 N021 N020 N028 0 NMOS l=l w=w
M7 N013 N012 VDD VDD PMOS l=l w=w
M9 N021 N020 N013 VDD PMOS l=l w=w
M3 N029 IREF 0 0 NMOS l=l w=w
M8 N022 N021 N029 0 NMOS l=l w=w
M10 N014 N012 VDD VDD PMOS l=l w=w
M11 N022 N021 N014 VDD PMOS l=l w=w
M12 N030 IREF 0 0 NMOS l=l w=w
M13 N023 N022 N030 0 NMOS l=l w=w
M14 N015 N012 VDD VDD PMOS l=l w=w
M15 N023 N022 N015 VDD PMOS l=l w=w
M16 N031 IREF 0 0 NMOS l=l w=w
M17 N024 N023 N031 0 NMOS l=l w=w
M18 N016 N012 VDD VDD PMOS l=l w=w
M19 N024 N023 N016 VDD PMOS l=l w=w
M20 N032 IREF 0 0 NMOS l=l w=w
M21 N020 N024 N032 0 NMOS l=l w=w
M22 N017 N012 VDD VDD PMOS l=l w=w
M23 N020 N024 N017 VDD PMOS l=l w=w
C2 Vsaw 0 {120f}
M24 Vsaw NOR 0 0 NMOS l=0.35u w=4u
C1 Vsaw2 0 120f
M26 Vsaw2 NOR 0 0 NMOS l=0.35u w=4u
M32 nout out 0 0 NMOS l=l w=w
M33 nout out VDD VDD PMOS l=l w=w
M36 N003 N003 VDD VDD PMOS l=0.35u w={1u}
M37 Vsaw2 N003 VDD VDD PMOS l=0.75u w={2u}
M34 N003 IREF 0 0 NMOS l=0.35u w=2u
M35 N001 N001 VDD VDD PMOS l=0.35u w={1u}
M38 Vsaw N001 VDD VDD PMOS l=0.75u w={2u}
M39 N001 IREF 0 0 NMOS l=0.35u w=2u
M40 N025 N020 0 0 NMOS l=l w=w
M41 N025 N020 VDD VDD PMOS l=l w=w
M42 out N025 0 0 NMOS l=l w=w
M43 out N025 VDD VDD PMOS l=l w=w
M45 N002 B VDD VDD PMOS l=0.35u w=0.4u
M44 N004 B 0 0 NMOS l=0.35u w=2u
M46 N002 A VDD VDD PMOS l=0.35u w=1u
M47 N002 A N004 0 NMOS l=0.35u w=20u
M50 NOR nout 0 0 NMOS l=0.35u w=0.4u
M51 NOR out 0 0 NMOS l=0.35u w=2u
M52 P001 nout VDD VDD PMOS l=0.35u w=50u
M53 NOR out P001 VDD PMOS l=0.35u w=10u
M65 N039 N038 0 0 NMOS l=los w=wos
M66 N039 N038 VDD VDD PMOS l=los w=wos
M67 N040 N039 0 0 NMOS l=los w=wos
M68 N040 N039 VDD VDD PMOS l=los w=wos
M69 N038 clk 0 0 NMOS l=los w=wos
M70 N038 clk VDD VDD PMOS l=los w=wos
M71 N041 N040 0 0 NMOS l=los w=wos
M72 N041 N040 VDD VDD PMOS l=los w=wos
M73 N042 N041 0 0 NMOS l=los w=wos
M74 N042 N041 VDD VDD PMOS l=los w=wos
M57 N043 N042 0 0 NMOS l=los w=wos
M58 N043 N042 VDD VDD PMOS l=los w=wos
M64 clk N043 0 0 NMOS l=los w=wos
M75 clk N043 VDD VDD PMOS l=los w=wos
M76 clk IREF 0 0 NMOS l=0.7u w=1u
R2 N035 out_comp 20k
C4 N035 0 40f
M81 N036 N035 N037 0 NMOS l=350n w=1u
M82 N036 N035 VDD VDD PMOS l=0.35u w=50u
M83 N037 N037 0 0 NMOS l=0.35u w=50u
M84 PWM N036 0 0 NMOS l=l w=w
M85 PWM N036 VDD VDD PMOS l=l w=w
M95 N034 clk 0 0 NMOS l=l3 w=w3
M96 N026 Vsaw N034 0 NMOS l=l3 w=w3
M97 N027 N033 N034 0 NMOS l=l3 w=w3
M98 N011 out_comp N026 0 NMOS l=l3 w=w3
M99 out_comp N011 N027 0 NMOS l=l3 w=w3
M100 N011 clk VDD VDD PMOS l=l3 w=w3
M101 N011 out_comp VDD VDD PMOS l=l3 w=w3
M102 out_comp clk VDD VDD PMOS l=l3 w=w3
M103 out_comp N011 VDD VDD PMOS l=l3 w=w3
M104 N026 clk VDD VDD PMOS l=l3 w=w3
M105 N027 clk VDD VDD PMOS l=l3 w=w3
V7 N033 0 2 Rser=10k
C6 N033 0 1p
M25 N005 vin N009 0 NMOS l=lota w=wota
V1 vin 0 1 Rser=10k
M27 N006 test N009 0 NMOS l=lota w=wota
M28 N018 N018 0 0 NMOS l=lota w=wota
M30 N008 N018 0 0 NMOS l=lota w={2*wota}
M31 N009 current 0 0 NMOS l=lota w=wota
M29 N018 N005 VDD VDD PMOS l=lota w={2*wota}
M48 N005 N005 VDD VDD PMOS l=lota w={wota}
M49 N008 N006 VDD VDD PMOS l=lota w={2*wota}
M54 N006 N006 VDD VDD PMOS l=lota w={wota}
R3 VDD test 50k
M55 test N008 N019 0 NMOS l=lota w=wota
M56 N019 N019 0 0 NMOS l=lota w=wota
M77 N010 N019 0 0 NMOS l=lota w={wota}
M78 current current 0 0 NMOS l=lota w=wota
M79 current vin VDD VDD PMOS l=lota w={wota}
M80 N007 N010 0 0 NMOS l=lota w={wota}
.model NMOS NMOS
.model PMOS PMOS
.lib standard.mos
.inc library.mod
.param w=6u
.param l=0.45u
.tran 5u
.meas tran T1 find time when V(clk)=1.65 rise 30
.meas tran T2 find time when V(clk)=1.65 rise 60
.meas TRAN Frequency PARAM 30/(T2-T1)
*.step param i list 1u 2u 4u 8u 16u 32u
.param Cl={50f}
.param w1=3u
.param l1=0.35u
* .tran 0 5u 2u 1n
*.step param i2 list 1u 32u
* Theorical Test
*.step param Vctrl list  1.5 2.0 2.5 3.0
* SAWTOOTH
.param w3=5u
.param l3=0.35u
.param wos=3u
.param los=1u
* PWM Generator
* Oscillator
.param wota=1u
.param lota=0.4u
.backanno
.end